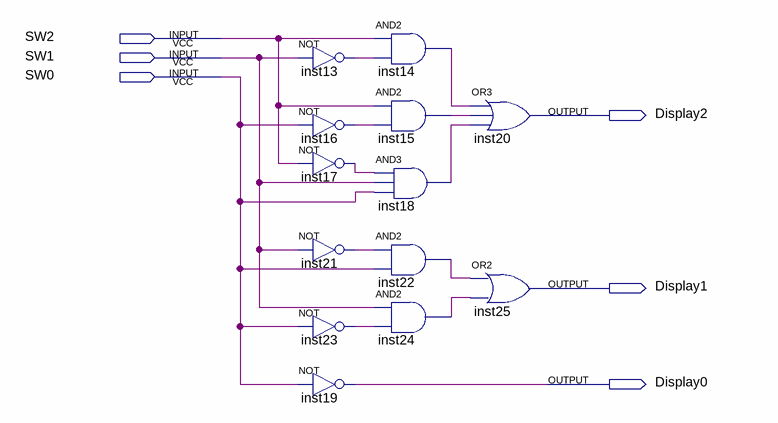
[diagram p0: schematic sheet]
// Quartus schematic INC.bdf as structural Verilog: 13 symbols, 6 pins
module INC (
  input  SW2,
  input  SW1,
  input  SW0,
  output Display2,
  output Display1,
  output Display0
);

  wire inst13_out, inst14_out, inst15_out, inst16_out, inst17_out, inst18_out, inst21_out, inst22_out,
       inst23_out, inst24_out;

  not inst13 (inst13_out, SW1);
  not inst16 (inst16_out, SW0);
  not inst17 (inst17_out, SW2);
  not inst21 (inst21_out, SW1);
  not inst23 (inst23_out, SW0);
  not inst19 (Display0, SW0);
  and inst14 (inst14_out, SW2, inst13_out);
  and inst15 (inst15_out, SW2, inst16_out);
  and inst18 (inst18_out, inst17_out, SW1, SW0);
  and inst22 (inst22_out, inst21_out, SW0);
  and inst24 (inst24_out, SW1, inst23_out);
  or inst20 (Display2, inst14_out, inst15_out, inst18_out);
  or inst25 (Display1, inst22_out, inst24_out);
endmodule
